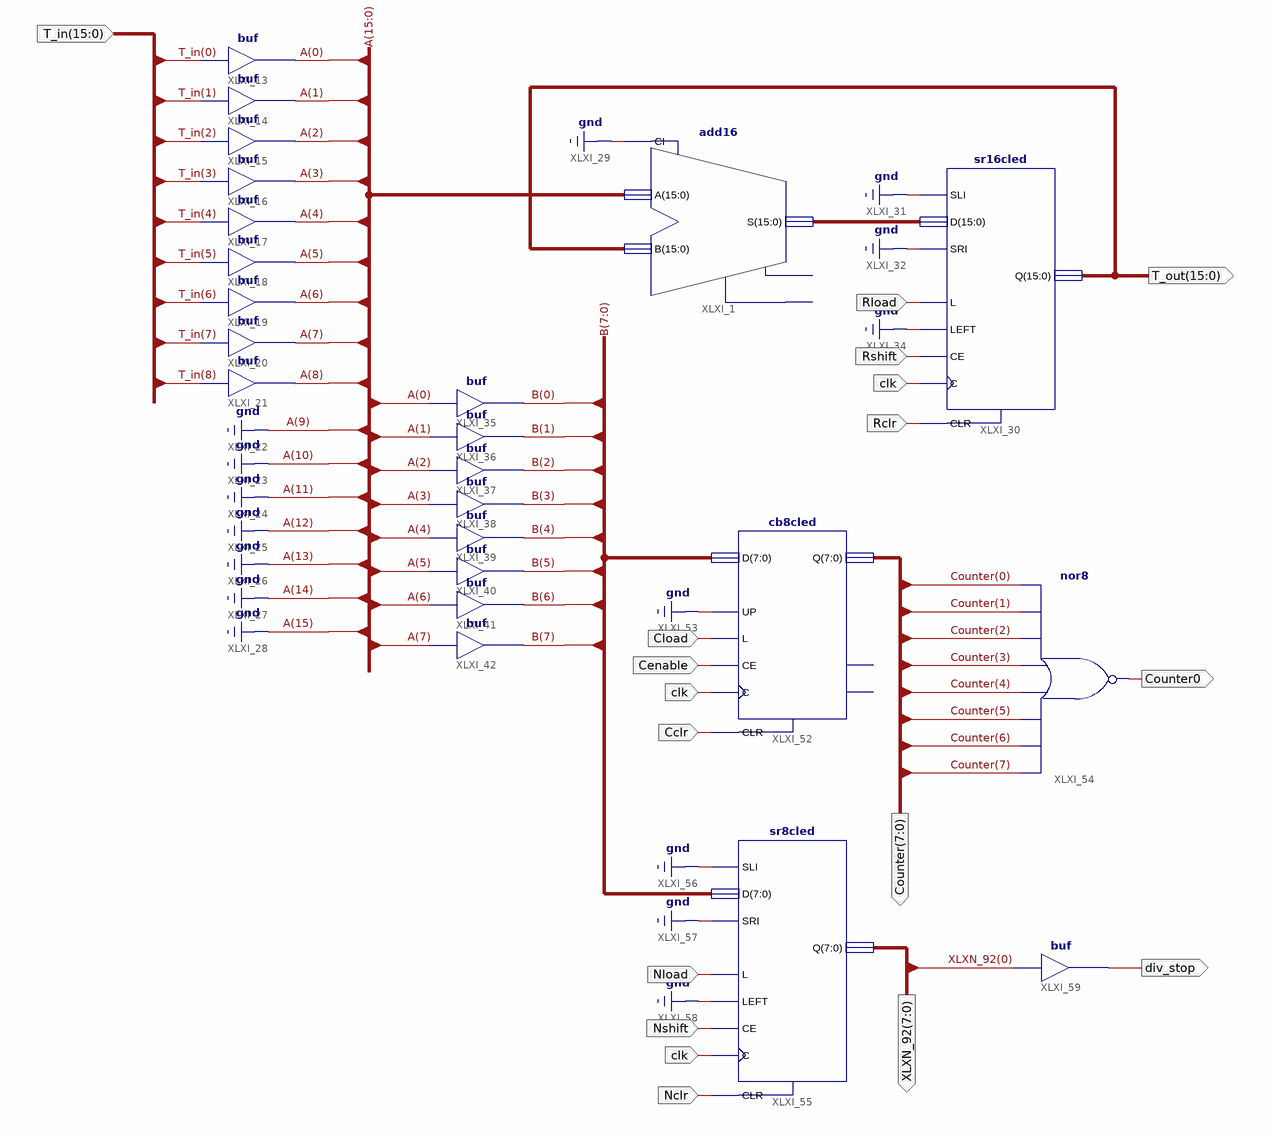
[diagram p0: schematic sheet 1]
// Xilinx ISE schematic datapath.sch (spartan3a) as structural Verilog: 23 symbols, 16 ports
module datapath (
  input  [15:0] T_in,
  input  Rshift,
  input  clk,
  input  Rclr,
  input  Rload,
  input  Cenable,
  input  Cload,
  input  Cclr,
  input  Nclr,
  input  Nshift,
  input  Nload,
  output [15:0] T_out,
  output [7:0] Counter,
  output Counter0,
  output [7:0] XLXN_92,
  output div_stop
);

  wire [7:0] B;
  wire [8:0] A;
  wire [15:0] XLXN_39;

  add16 XLXI_1 (.A({{7{1'b0}}, A}), .B(T_out), .CI(1'b0), .S(XLXN_39));  // open: CO, OFL
  buf XLXI_13 (A[0], T_in[0]);
  buf XLXI_14 (A[1], T_in[1]);
  buf XLXI_15 (A[2], T_in[2]);
  buf XLXI_16 (A[3], T_in[3]);
  buf XLXI_17 (A[4], T_in[4]);
  buf XLXI_18 (A[5], T_in[5]);
  buf XLXI_19 (A[6], T_in[6]);
  buf XLXI_20 (A[7], T_in[7]);
  buf XLXI_21 (A[8], T_in[8]);
  sr16cled XLXI_30 (
    .C(clk), .CE(Rshift), .CLR(Rclr), .D(XLXN_39), .L(Rload), .LEFT(1'b0), .SLI(1'b0), .SRI(1'b0), .Q(T_out));
  buf XLXI_40 (B[5], A[5]);
  buf XLXI_41 (B[6], A[6]);
  buf XLXI_42 (B[7], A[7]);
  buf XLXI_39 (B[4], A[4]);
  buf XLXI_38 (B[3], A[3]);
  buf XLXI_37 (B[2], A[2]);
  buf XLXI_36 (B[1], A[1]);
  buf XLXI_35 (B[0], A[0]);
  cb8cled XLXI_52 (.C(clk), .CE(Cenable), .CLR(Cclr), .D(B), .L(Cload), .UP(1'b0), .Q(Counter));  // open: CEO, TC
  nor XLXI_54 (Counter0, Counter[7], Counter[6], Counter[5], Counter[4], Counter[3], Counter[2], Counter[1], Counter[0]);
  sr8cled XLXI_55 (
    .C(clk), .CE(Nshift), .CLR(Nclr), .D(B), .L(Nload), .LEFT(1'b0), .SLI(1'b0), .SRI(1'b0), .Q(XLXN_92));
  buf XLXI_59 (div_stop, XLXN_92[0]);
endmodule
